# Altium schematic sheet 99.Mark_Hole_Heatsink.SchDoc
size 297 x 209 mm; Revision: V2.1; Schematic Page Number: 11; Page Number: 43; Check: Default; Schematic Name: RK_NVR_DEMO1_RK3588_LP4/4x_V21; Page Count: 43; Page name: 99.Mark/Hole/Heatsink; Designer: Zhangdz; Schematic Page Count: 99; Revcode: V2.1; DsnPath: E:\Work\SBER\RK3588_SOM\temp\RK_NVR_DEMO1_RK3588_LP4XD200P232SD8_V21_20211228.DSN; SchematicName: RK_NVR_DEMO1_RK3588_LP4/4x_V21; PageName: 99.Mark/Hole/Heatsink; PageSize: A4; TopSchematic: True
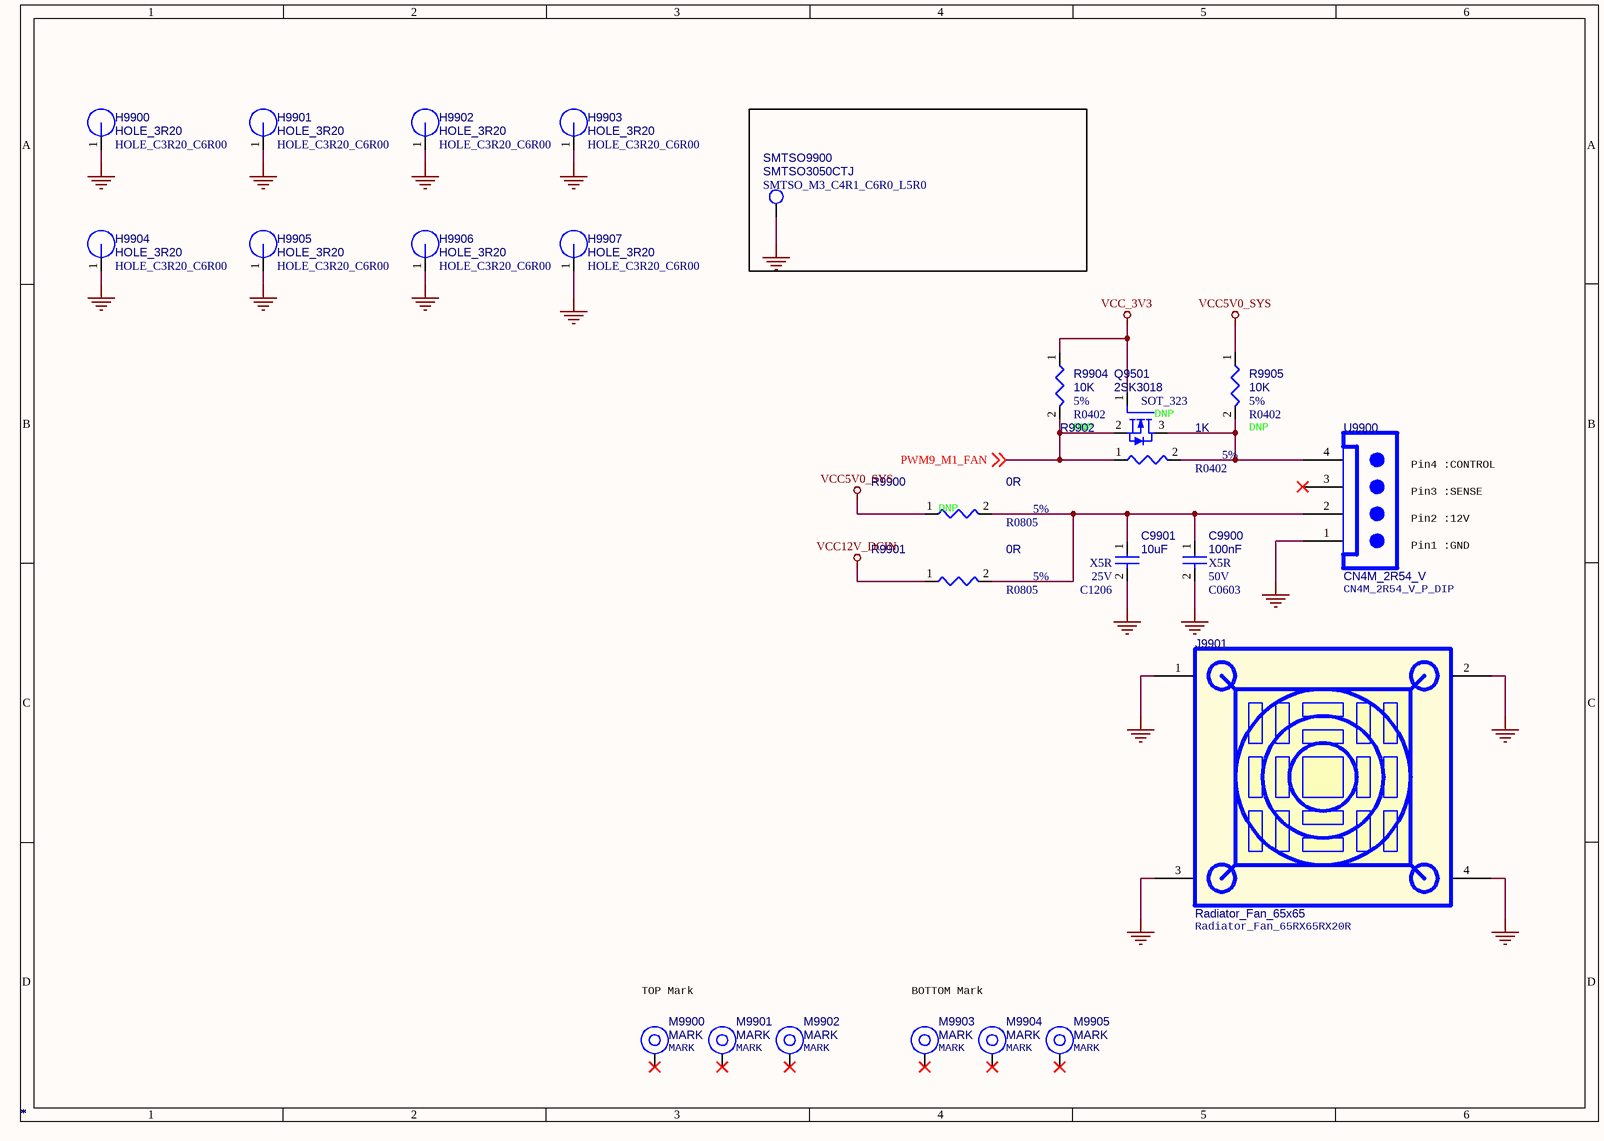
[diagram p0: 99.Mark_Hole_Heatsink.SchDoc]

## Parts
C9900  *  Voltage: 50V  Dielectric: X5R  [C0603]
C9901  *  Voltage: 25V  Dielectric: X5R  [C1206]
H9900  *  PCB Footprint: HOLE_C3R20_C6R00  [H3.8MM]
H9901  *  PCB Footprint: HOLE_C3R20_C6R00  [H3.8MM]
H9902  *  PCB Footprint: HOLE_C3R20_C6R00  [H3.8MM]
H9903  *  PCB Footprint: HOLE_C3R20_C6R00  [H3.8MM]
H9904  *  PCB Footprint: HOLE_C3R20_C6R00  [H3.8MM]
H9905  *  PCB Footprint: HOLE_C3R20_C6R00  [H3.8MM]
H9906  *  PCB Footprint: HOLE_C3R20_C6R00  [H3.8MM]
H9907  *  PCB Footprint: HOLE_C3R20_C6R00  [H3.8MM]
J9901  *  [Radiator_Fan_65RX65RX20R]
M9900  *  [MARK]
M9901  *  [MARK]
M9902  *  [MARK]
M9903  *  [MARK]
M9904  *  [MARK]
M9905  *  [MARK]
Q9501  *  PCB Footprint: SOT_323  OPTION: DNP  [SOT23]
R9900  *  PCB Footprint: R0805  Tolerance: 5%  OPTION: DNP  [R0402]
R9901  *  PCB Footprint: R0805  Tolerance: 5%  [R0402]
R9902  *  Tolerance: 5%  [R0402]
R9904  *  Tolerance: 5%  OPTION: DNP  [R0402]
R9905  *  Tolerance: 5%  OPTION: DNP  [R0402]
SMTSO9900  *  PCB Footprint: SMTSO_M3_C4R1_C6R0_L5R0  [TEST]
U9900  *  [CN4M_2R54_V_P_DIP]

## Nets
GND: C9900.2 C9901.2 H9900.1 H9901.1 H9902.1 H9903.1 H9904.1 H9905.1 H9906.1 H9907.1 J9901.1 J9901.2 J9901.3 J9901.4 SMTSO9900.1 U9900.1(GND)
VCC5V0_SYS: R9900.1 R9905.1
VCC12V_DCIN: R9901.1
VCC_3V3: Q9501.1(GATE) R9904.1
PWM9_M1_FAN: Q9501.2(SOURCE) R9902.1 R9904.2 ; off-sheet PWM9_M1_FAN
NetC9900_1: C9900.1 C9901.1 R9900.2 R9901.2 U9900.2(RX)
NetQ9501_3: Q9501.3(DRAIN) R9902.2 R9905.2 U9900.4(3V3)

Not connected (* = marked no-connect by the designer): M9900 1*; M9901 1*; M9902 1*; M9903 1*; M9904 1*; M9905 1*; U9900 3(TX)*

## Notes on the sheet
- Pin4 :CONTROL
- Pin2 :12V
- Pin3 :SENSE
- Pin1 :GND
- TOP Mark
- BOTTOM Mark

## Library data of the parts
C9900 = CAP NP: cap,100.00nF,+/-10%,50V,X5R,C0603; Part Reference: C9900; Manufacturer: TDK; Value: 100nF; RK PN: C1608X5R1H104K080AA; Priority: A; Tolerance: 10%; PCB Footprint: C0603; Part Type: C0603; Manufacturer PN: C1608X5R1H104K080AA; Created by: JJJ
C9901 = CAP NP: cap,10.00uF,+/-10%,25V,X5R,C1206; Part Reference: C9901; Manufacturer PN: C3216X5R1E106K085AC; Manufacturer: TDK; Value: 10uF; Tolerance: 10%; C_Voltage: 6.3V; Priority: A; PCB Footprint: C1206; Created by: JJJ; Part Type: C1206; RK PN: C3216X5R1E106K085AC
H9900 = Hole: Ц±ѕ¶3.2mmВЭЛїїЧ,ОЮН­Цщ; Part Reference: H9900; Value: HOLE_3R20; Priority: A; RK PN: HOLE_3R20; Part Type: HOLE; Created by: YWQ
H9901 = Hole: Ц±ѕ¶3.2mmВЭЛїїЧ,ОЮН­Цщ; Part Reference: H9901; Value: HOLE_3R20; Priority: A; RK PN: HOLE_3R20; Part Type: HOLE; Created by: YWQ
H9902 = Hole: Ц±ѕ¶3.2mmВЭЛїїЧ,ОЮН­Цщ; Part Reference: H9902; Value: HOLE_3R20; Priority: A; RK PN: HOLE_3R20; Part Type: HOLE; Created by: YWQ
H9903 = Hole: Ц±ѕ¶3.2mmВЭЛїїЧ,ОЮН­Цщ; Part Reference: H9903; Value: HOLE_3R20; Priority: A; RK PN: HOLE_3R20; Part Type: HOLE; Created by: YWQ
H9904 = Hole: Ц±ѕ¶3.2mmВЭЛїїЧ,ОЮН­Цщ; Part Reference: H9904; Value: HOLE_3R20; Priority: A; Created by: YWQ; Part Type: HOLE; RK PN: HOLE_3R20
H9905 = Hole: Ц±ѕ¶3.2mmВЭЛїїЧ,ОЮН­Цщ; Part Reference: H9905; Value: HOLE_3R20; Priority: A; RK PN: HOLE_3R20; Part Type: HOLE; Created by: YWQ
H9906 = Hole: Ц±ѕ¶3.2mmВЭЛїїЧ,ОЮН­Цщ; Part Reference: H9906; Value: HOLE_3R20; Priority: A; Created by: YWQ; Part Type: HOLE; RK PN: HOLE_3R20
H9907 = Hole: Ц±ѕ¶3.2mmВЭЛїїЧ,ОЮН­Цщ; Part Reference: H9907; Value: HOLE_3R20; Priority: A; RK PN: HOLE_3R20; Part Type: HOLE; Created by: YWQ
J9901 = Radiator_Fan_2: Part Reference: J9901; Value: Radiator_Fan_65x65; PCB Footprint: Radiator_Fan_65RX65RX20R
M9900 = MARK: MARK Symble; Part Reference: M9900; RK PN: MARK01; Priority: A; PCB Footprint: MARK; Value: MARK; Part Type: MARK; Created by: JJJ
M9901 = MARK: MARK Symble; Part Reference: M9901; RK PN: MARK01; Priority: A; PCB Footprint: MARK; Value: MARK; Part Type: MARK; Created by: JJJ
M9902 = MARK: MARK Symble; Part Reference: M9902; RK PN: MARK01; Priority: A; PCB Footprint: MARK; Value: MARK; Part Type: MARK; Created by: JJJ
M9903 = MARK: MARK Symble; Part Reference: M9903; Priority: A; RK PN: MARK01; PCB Footprint: MARK; Value: MARK; Created by: JJJ; Part Type: MARK
M9904 = MARK: MARK Symble; Part Reference: M9904; Priority: A; RK PN: MARK01; PCB Footprint: MARK; Value: MARK; Created by: JJJ; Part Type: MARK
M9905 = MARK: MARK Symble; Part Reference: M9905; RK PN: MARK01; Priority: A; PCB Footprint: MARK; Value: MARK; Part Type: MARK; Created by: JJJ
Q9501 = MOSFET N: NMOS,2SK3018,SOT_323,Id=0.1A,Vds=30V; Part Reference: Q9501; Manufacturer: ROHM; Pd: 0.2W; Vgsth: 1.5V; VDS: 30V; Vgs: 20V; Id_max: 0.1A; Priority: A; Rds: 5ohm; Value: 2SK3018; Created by: JJJ; Manufacturer PN: 2SK3018; Part Type: NMOS; RK PN: 2SK3018
R9900 = RESISTOR_Dup1: НЁУГєсД¤µзЧи,0R,+/-5%,R0805,1/8W.; Part Reference: R9900; Manufacturer PN: RC0805JR-070RL; Manufacturer: YAGEO; Wattage: 1/8W; Priority: A; Value: 0R; Created by: YTL; Part Type: НЁУГєсД¤µзЧи; RK PN: RC0805JR-070RL
R9901 = RESISTOR_Dup1: НЁУГєсД¤µзЧи,0R,+/-5%,R0805,1/8W.; Part Reference: R9901; Manufacturer PN: RC0805JR-070RL; Manufacturer: YAGEO; Wattage: 1/8W; Priority: A; Value: 0R; Created by: YTL; Part Type: НЁУГєсД¤µзЧи; RK PN: RC0805JR-070RL
R9902 = RESISTOR_Dup1: НЁУГєсД¤µзЧи,1K,+/-5%,R0402,1/16W.; Part Reference: R9902; Manufacturer: YAGEO; RK PN: RC0402JR-071KL; Priority: A; Wattage: 1/16W; PCB Footprint: R0402; Value: 1K; Part Type: НЁУГєсД¤µзЧи; Manufacturer PN: RC0402JR-071KL; Created by: YTL
R9904 = RESISTOR_Dup1: НЁУГєсД¤µзЧи,10K,+/-5%,R0402,1/16W.; Part Reference: R9904; Manufacturer PN: RC0402JR-0710KL; Manufacturer: YAGEO; Wattage: 1/16W; Priority: A; PCB Footprint: R0402; Value: 10K; Created by: YTL; Part Type: НЁУГєсД¤µзЧи; RK PN: RC0402JR-0710KL
R9905 = RESISTOR_Dup1: НЁУГєсД¤µзЧи,10K,+/-5%,R0402,1/16W.; Part Reference: R9905; Manufacturer PN: RC0402JR-0710KL; Manufacturer: YAGEO; Wattage: 1/16W; Priority: A; PCB Footprint: R0402; Value: 10K; Created by: YTL; Part Type: НЁУГєсД¤µзЧи; RK PN: RC0402JR-0710KL
SMTSO9900 = SMTSO: єёЅУВЭДёM3,ёЯ¶И5mmЈ»; Part Reference: SMTSO9900; Value: SMTSO3050CTJ; Priority: A; RK PN: SMTSO3050CTJ; Part Type: SMTSO; Created by: JJJ
U9900 = CON4_0: Part Reference: U9900; Value: CN4M_2R54_V; PCB Footprint: CN4M_2R54_V_P_DIP